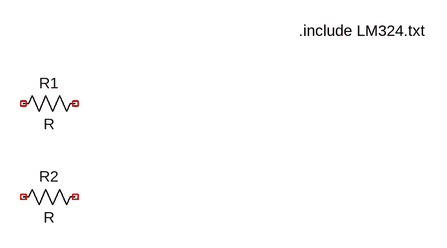
[diagram p0: schematic Draft3.asc]
Draft3.asc, the LTspice schematic file:
Version 4
SHEET 1 880 680
SYMBOL res 96 128 R90
WINDOW 0 0 56 VBottom 2
WINDOW 3 32 56 VTop 2
SYMATTR InstName R1
SYMBOL res 96 272 R90
WINDOW 0 0 56 VBottom 2
WINDOW 3 32 56 VTop 2
SYMATTR InstName R2
TEXT 424 32 Left 2 !.include LM324.txt

The netlist it stands for:
* Draft3.asc
R1 NC_01 NC_02 R
R2 NC_03 NC_04 R
.include LM324.txt
.backanno
.end